# EAGLE design ts19390-boost-24mm-9leds-mk-1 (EAGLE 6.5.0)
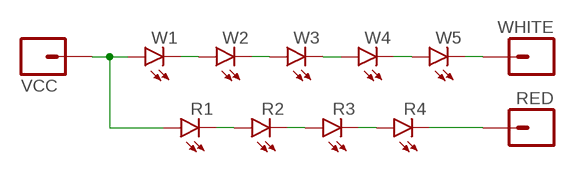
[diagram p0: schematic, sheet 1]

## Parts
R1  LED5MM_SHORTPADS  [LED5MM_SHORTPADS]
R2  LED5MM_SHORTPADS  [LED5MM_SHORTPADS]
R3  LED5MM_SHORTPADS  [LED5MM_SHORTPADS]
R4  LED5MM_SHORTPADS  [LED5MM_SHORTPADS]
RED  M01PTH-NS-NOTSUCK  [1X01NSATALL]
VCC  M01PTH-NS-NOTSUCK  [1X01NSATALL]
W1  LED5MM_SHORTPADS  [LED5MM_SHORTPADS]
W2  LED5MM_SHORTPADS  [LED5MM_SHORTPADS]
W3  LED5MM_SHORTPADS  [LED5MM_SHORTPADS]
W4  LED5MM_SHORTPADS  [LED5MM_SHORTPADS]
W5  LED5MM_SHORTPADS  [LED5MM_SHORTPADS]
WHITE  M01PTH-NS-NOTSUCK  [1X01NSATALL]

## Nets
N$1: W1.K(C) W2.A
N$2: W2.K(C) W3.A
N$3: W3.K(C) W4.A
N$4: W4.K(C) W5.A
N$5: R1.K(C) R2.A
N$6: R2.K(C) R3.A
N$7: W5.K(C) WHITE.1
N$8: R3.K(C) R4.A
N$9: R4.K(C) RED.1
N$10: R1.A VCC.1 W1.A

## Library data of the parts
R1-R4 W1-W5 = A_butts:LED: LEDs Standard schematic elements and footprints for 5mm, 3mm, 1206, and 0603 sized LEDs. 5mm - Spark Fun Electronics SKU : COM-00529 (and others)
RED VCC WHITE = A_butts:M01: Header 1 Standard 1-pin 0.1" header. Use with straight break away headers (SKU : PRT-00116), right angle break away headers (PRT-00553), swiss pins (PRT-00743), machine pins (PRT-00117), and female headers (PRT-00115).

## Board
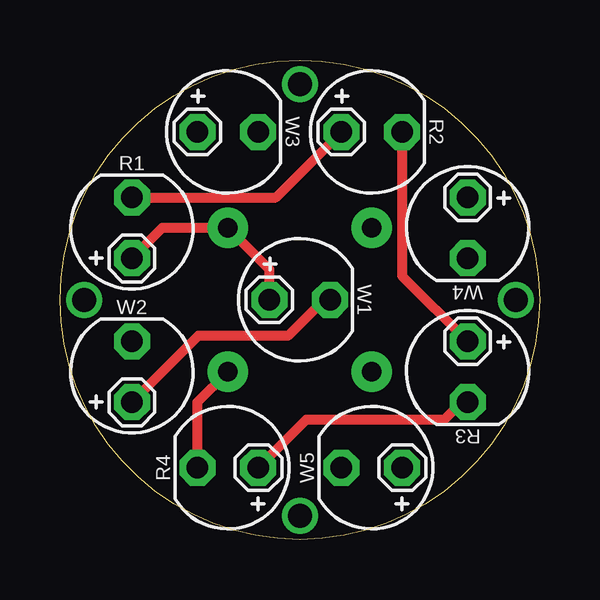
[diagram p1: board, top side]
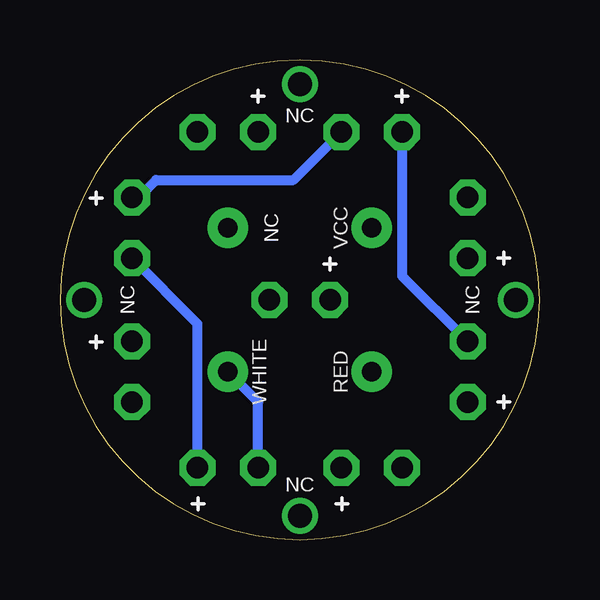
[diagram p2: board, bottom side, seen from below]

Size 20 x 20 mm. Coordinates in mm from the lower left corner, seen from the top.
Outline: 10,0 arc-90 0,10 arc-90 10,20 arc-90 20,10 arc-90 10,0
Copper layers (1*16): Top 0.0356mm / dielectric 1.5011mm / Bottom 0.0356mm
Design rules "LaenPCBOrder2": minimum track width 6mil, minimum drill 13mil, track to track 6mil, track to pad 6mil, pad to pad 6mil, via to via 6mil, smd to smd 6mil, copper to edge 15mil, drill to drill 6mil, minimum pad ring 7mil, minimum via ring 7mil, stop-mask expansion 3mil, vias tented up to drill 20mil, thermal gap 10mil

### Footprints (pad centres in the part's own frame; a part is rotated, then mirrored left to right if it is on the bottom)
LED5MM_SHORTPADS = drill 0.9 pad 1.5 octagon: A -1.27,0; K 1.27,0
1X01NSATALL = drill 0.8 pad 1.676: 1 0,0

### Placement (x,y rotation side)
R1  3,13 90 top
R2  13,17 0 top
R3  17,7 270 top
R4  7,3 180 top
RED  7,7 90 bottom
VCC  7,13 90 bottom
W1  10,10 0 top
W2  3,7 90 top
W3  7,17 0 top
W4  17,13 270 top
W5  13,3 180 top
WHITE  13,7 270 bottom

### Tracks (layer width: path | path; a pad name or v marks a point on that pad's centre or on a via)
N$1
  Top 0.406: W1.K 11,10 9.5,8.5 5.77,8.5 W2.A
N$2
  Bottom 0.406: W3.A 5.73,11 W2.K
N$3
  Bottom 0.406: W4.A 16.73,14.27 16,15 10.27,15 W3.K
N$4
  Bottom 0.406: W5.A 14.27,9 W4.K
N$5
  Top 0.406: R1.K 9,14.27 R2.A
N$6
  Top 0.406: R2.K 14.27,11 R3.A
N$7
  Bottom 0.406: W5.K 11.73,5.73 WHITE.1
N$8
  Top 0.406: R3.K 16.73,5.73 16,5 10.27,5 R4.A
N$9
  Top 0.406: R4.K 5.73,5.73 RED.1
N$10
  Top 0.406: W1.A 8.73,11.27 VCC.1 4.27,13 R1.A
N$11  (via drill 1)
  other vias: 1,10
N$12  (via drill 1)
  other vias: 10,19
N$13  (via drill 1)
  other vias: 19,10
N$14  (via drill 1)
  other vias: 10,1
N$15  (via drill 0.8 pad 1.68)
  other vias: 13,13

### Text on the board
bPlace: NC | NC | NC | NC | NC